# Altium schematic sheet Charger.SchDoc
size A4
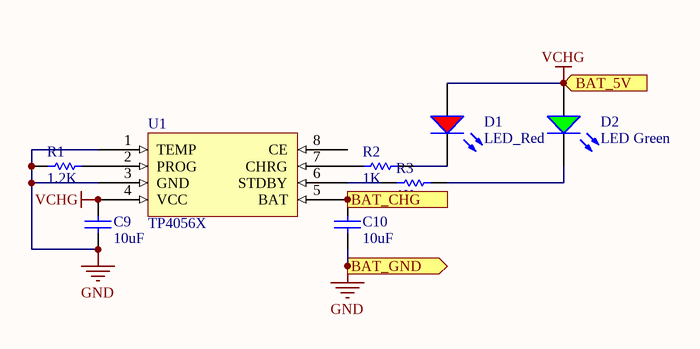
[diagram p0: Charger.SchDoc]

## Parts
C9  10uF  [SMC_0805]
C10  10uF  [SMC_0805]
D1  LED_Red  [SMLED_0603]
D2  LED Green  [SMLED_0603]
R1  1.2K  [SMR_0402]
R2  1K  [SMR_0402]
R3  1K  [SMR_0402]
U1  TP4056X  [SOIC127P600X175_HS-9N]

## Ports
BAT_5V (in), BAT_CHG (out), BAT_GND (out)

## Nets
GND: C9.1 C10.1 R1.1 U1.1(TEMP) U1.3(GND) ; port BAT_GND
VCHG: C9.2 D1.A D2.A U1.4(VCC) ; port BAT_5V
BAT_CHG: C10.2 U1.5(BAT) ; port BAT_CHG
NetD1_K: D1.K R2.2
NetD2_K: D2.K R3.2
NetR1_2: R1.2 U1.2(PROG)
NetR2_1: R2.1 U1.7(CHRG)
NetR3_1: R3.1 U1.6(STDBY)

Not connected (* = marked no-connect by the designer): U1 8(CE)

## Library data of the parts
C9 C10 = Cap Ceramic
R1-R3 = Res SMT